# EAGLE design simreader_marble_perfboard (EAGLE 6.6.0)
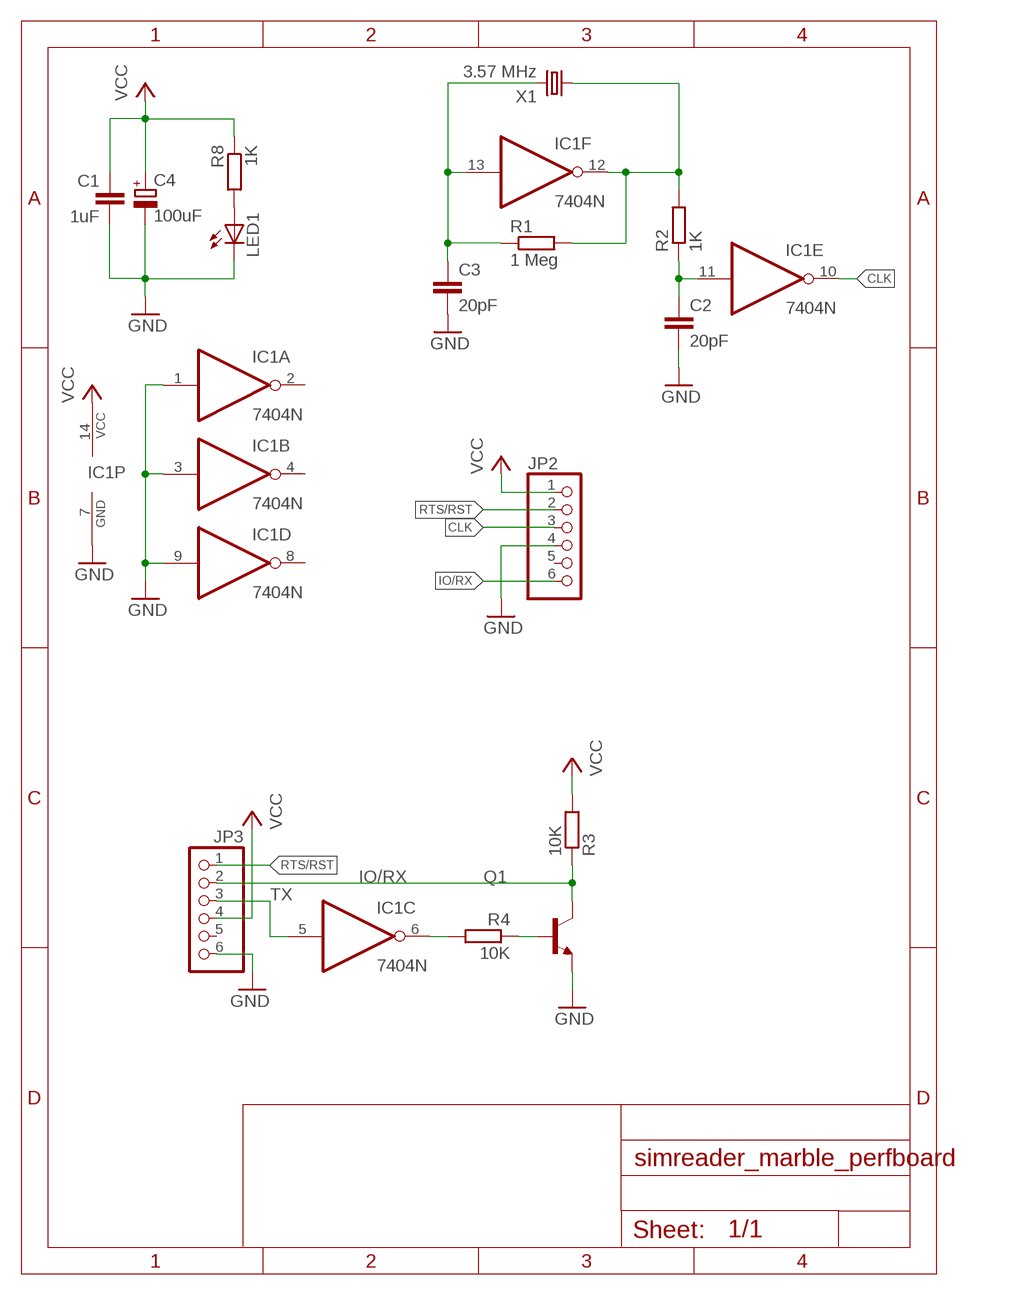
[diagram p0: schematic, sheet 1]

## Parts
C1  1uF  C-EU050-024X044  [C050-024X044]
C2  20pF  C-EU050-024X044  [C050-024X044]
C3  20pF  C-EU050-024X044  [C050-024X044]
C4  100uF  CPOL-EUB45181A  [B45181A]
IC1  7404N  [DIL14]
JP2  PINHD-1X6  [1X06]
JP3  PINHD-1X6  [1X06]
LED1  LED5MM  [LED5MM]
Q1  BC547-NPN-TO92-CBE  [TO92-CBE]
R1  1 Meg  R-EU_0204/7  [0204/7]
R2  1K  R-EU_0204/7  [0204/7]
R3  10K  R-EU_0204/7  [0204/7]
R4  10K  R-EU_0204/7  [0204/7]
R8  1K  R-EU_0204/7  [0204/7]
X1  3.57 MHz  CRYSTALHC18U-V  [HC18U-V]

## Nets
CLK: IC1.10(E:O) JP2.3
GND: C1.2 C2.2 C3.2 C4.- IC1.1(A:I) IC1.3(B:I) IC1.7(P:GND) IC1.9(D:I) JP2.4 JP3.6 LED1.K(C) Q1.E
IO/RX: JP2.6 JP3.2 Q1.C R3.1
N$1: C3.1 IC1.13(F:I) R1.1 X1.2
N$2: IC1.12(F:O) R1.2 R2.2 X1.1
N$3: C2.1 IC1.11(E:I) R2.1
N$4: IC1.6(C:O) R4.2
N$6: Q1.B R4.1
N$13: LED1.A R8.2
RTS/RST: JP2.2 JP3.1
TX: IC1.5(C:I) JP3.3
VCC: C1.1 C4.+ IC1.14(P:VCC) JP2.1 JP3.4 R3.2 R8.1
Unconnected: IC1.2(A:O) IC1.4(B:O) IC1.8(D:O) JP2.5 JP3.5

## Library data of the parts
C1-C3 = rcl:C-EU: CAPACITOR, European symbol
C4 = rcl:CPOL-EU: POLARIZED CAPACITOR, European symbol
IC1 = 74xx-us:74*04: Hex INVERTER
JP2 JP3 = pinhead:PINHD-1X6: PIN HEADER
LED1 = led:LED: LED OSRAM: - CHIPLED LG R971, LG N971, LY N971, LG Q971, LY Q971, LO R971, LY R971 LH N974, LH R974 LS Q976, LO Q976, LY Q976 LO Q996 - Hyper CHIPLED LW Q18S LB Q993, LB Q99A, LB R99A - SideLED LS A670, LO A670, LY A670, LG A670, LP A670 LB A673, LV A673, LT A673, LW A673 LH A674 LY A675 LS A676, LA A676, LO A676, LY A676, LW A676 LS A679, LY A679, LG A679 - Hyper Micro SIDELED® LS Y876, LA Y876, LO Y876, LY Y876 LT Y87S - SmartLED LW L88C, LW L88S LB L89C, LB L89S, LG L890 LS L89K, LO L89K, LY L89K LS L896, LA L896, LO L896, LY L896 - TOPLED LS T670, LO T670, LY T670, LG T670, LP T670 LSG T670, LSP T670, LSY T670, LOP T670, LYG T670 LG T671, LOG T671, LSG T671 LB T673, LV T673, LT T673, LW T673 LH T674 LS T676, LA T676, LO T676, LY T676, LB T676, LH T676, LSB T676, LW T676 LB T67C, LV T67C, LT T67C, LS T67K, LO T67K, LY T67K, LW E67C LS E67B, LA E67B, LO E67B, LY E67B, LB E67C, LV E67C, LT E67C LW T67C LS T679, LY T679, LG T679 LS T770, LO T770, LY T770, LG T770, LP T770 LB T773, LV T773, LT T773, LW T773 LH T774 LS E675, LA E675, LY E675, LS T675 LS T776, LA T776, LO T776, LY T776, LB T776 LHGB T686 LT T68C, LB T68C - Hyper Mini TOPLED® LB M676 - Mini TOPLED Santana® LG M470 LS M47K, LO M47K, LY M47K Source: http://www.osram.convergy.de LUXEON: - LUMILED® LXK2-PW12-R00, LXK2-PW12-S00, LXK2-PW14-U00, LXK2-PW14-V00 LXK2-PM12-R00, LXK2-PM12-S00, LXK2-PM14-U00 LXK2-PE12-Q00, LXK2-PE12-R00, LXK2-PE12-S00, LXK2-PE14-T00, LXK2-PE14-U00 LXK2-PB12-K00, LXK2-PB12-L00, LXK2-PB12-M00, LXK2-PB14-N00, LXK2-PB14-P00, LXK2-PB14-Q00 LXK2-PR12-L00, LXK2-PR12-M00, LXK2-PR14-Q00, LXK2-PR14-R00 LXK2-PD12-Q00, LXK2-PD12-R00, LXK2-PD12-S00 LXK2-PH12-R00, LXK2-PH12-S00 LXK2-PL12-P00, LXK2-PL12-Q00, LXK2-PL12-R00 Source: www.luxeon.com KINGBRIGHT: KA-3528ASYC Source: www.kingbright.com
Q1 = transistor:*-NPN-: NPN Transistror BF959 corrected 2008.03.06
R1-R4 R8 = rcl:R-EU_: RESISTOR, European symbol
X1 = crystal:CRYSTAL: CRYSTAL; OC_FARNELL: unknown; OC_NEWARK: unknown

## Board
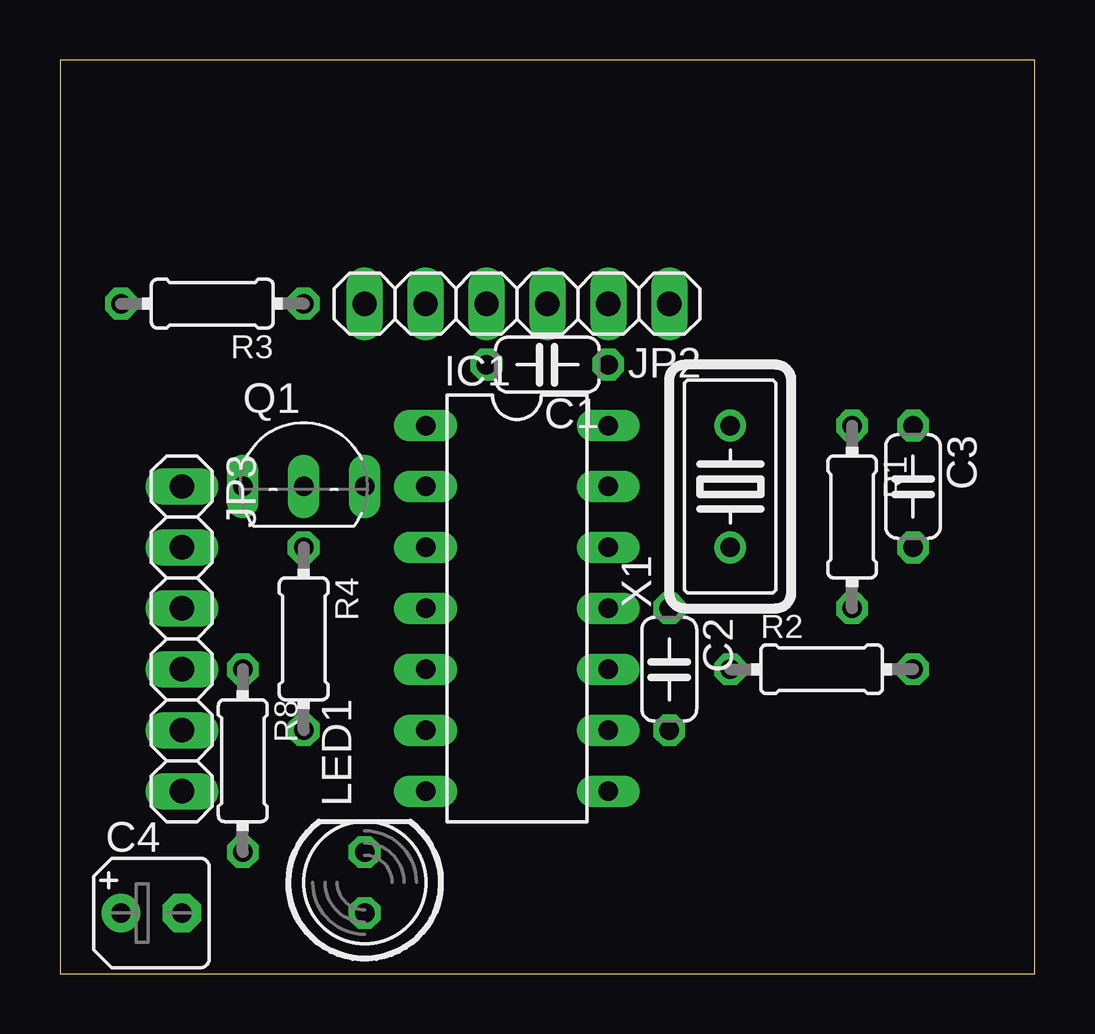
[diagram p1: board, top side]
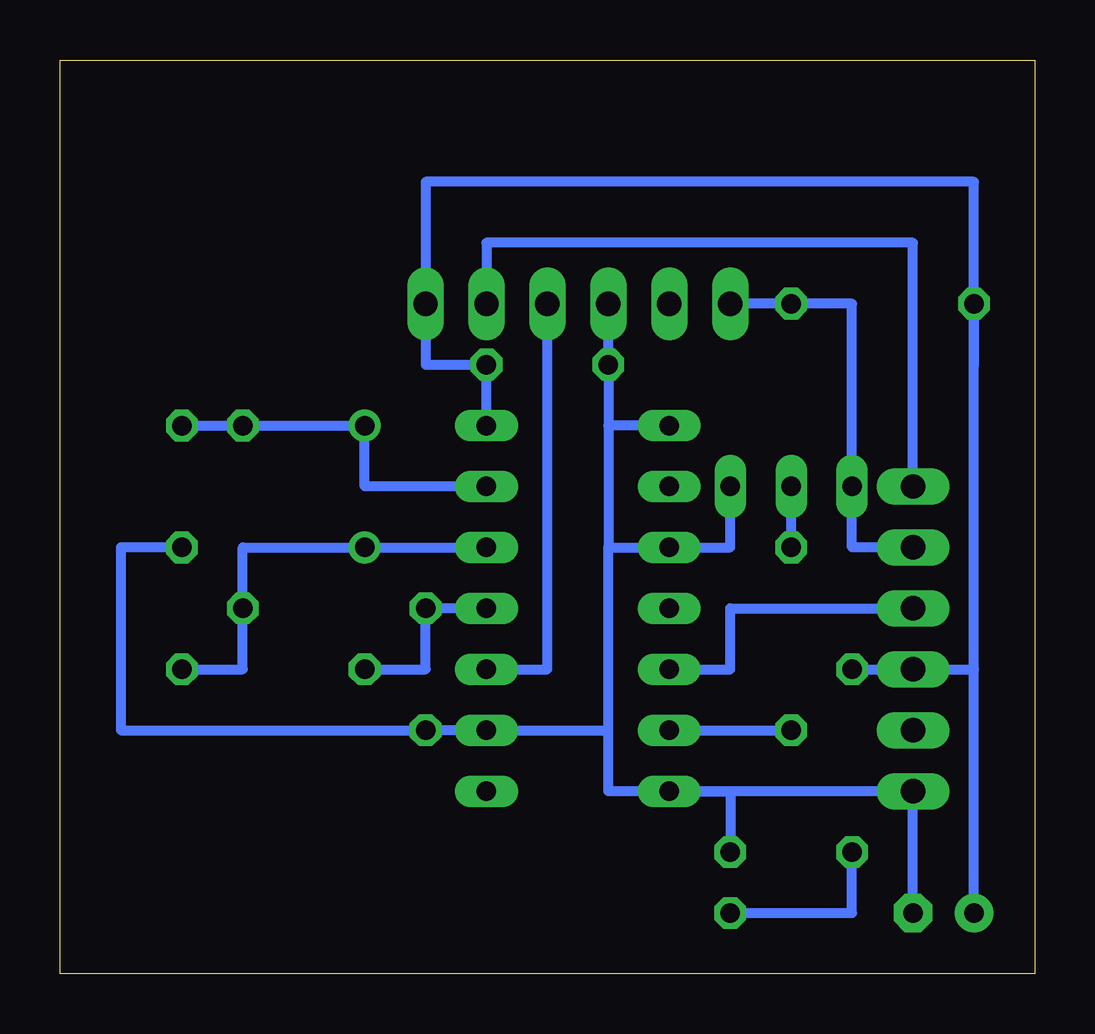
[diagram p2: board, bottom side, seen from below]

Size 40.64 x 38.1 mm. Coordinates in mm from the lower left corner, seen from the top.
Outline: 0,0 40.64,0 40.64,38.1 0,38.1 0,0
Copper layers (1*16): Top 0.035mm / dielectric 1.5mm / Bottom 0.035mm
Design rules "default": minimum track width 10mil, minimum drill 24mil, track to track 8mil, track to pad 8mil, pad to pad 8mil, via to via 8mil, smd to smd 8mil, copper to edge 40mil, drill to drill 8mil, minimum pad ring 10mil, minimum via ring 8mil, stop-mask expansion 4mil, vias tented up to drill 0mil, thermal gap 10mil

### Footprints (pad centres in the part's own frame; a part is rotated, then mirrored left to right if it is on the bottom)
C050-024X044 = drill 0.813 octagon: 1 -2.54,0; 2 2.54,0
B45181A = drill 0.813 pad 1.6: + -1.27,0 | drill 0.813 pad 1.6 octagon: - 1.27,0
DIL14 = drill 0.813 long: 1 -7.62,-3.81; 2 -5.08,-3.81; 3 -2.54,-3.81; 4 0,-3.81; 5 2.54,-3.81; 6 5.08,-3.81; 7 7.62,-3.81; 8 7.62,3.81; 9 5.08,3.81; 10 2.54,3.81; 11 0,3.81; 12 -2.54,3.81; 13 -5.08,3.81; 14 -7.62,3.81
1X06 = drill 1.016 long: 1 -6.35,0; 2 -3.81,0; 3 -1.27,0; 4 1.27,0; 5 3.81,0; 6 6.35,0
LED5MM = drill 0.813 octagon: A -1.27,0; K 1.27,0
TO92-CBE = drill 0.813 long: B 0,0; C -2.54,0; E 2.54,0
0204/7 = drill 0.813 octagon: 1 -3.81,0; 2 3.81,0
HC18U-V = drill 0.813: 1 -2.54,0; 2 2.54,0

### Placement (x,y rotation side)
C1  20.32,25.4 180 top
C2  25.4,12.7 270 top
C3  35.56,20.32 270 top
C4  3.81,2.54 0 top
IC1  19.05,15.24 270 top
JP2  19.05,27.94 180 top
JP3  5.08,13.97 270 top
LED1  12.7,3.81 90 top
Q1  10.16,20.32 0 top
R1  33.02,19.05 270 top
R2  31.75,12.7 0 top
R3  6.35,27.94 180 top
R4  10.16,13.97 270 top
R8  7.62,8.89 270 top
X1  27.94,20.32 90 top

### Tracks (layer width: path | path; a pad name or v marks a point on that pad's centre or on a via)
CLK
  Bottom 0.406: IC1.10 20.32,12.7 JP2.3
GND
  Bottom 0.406: 17.78,22.86 C1.2 JP2.4 | 17.78,22.86 17.78,17.78 | IC1.7 17.78,7.62 17.78,10.16 | 17.78,10.16 17.78,17.78 | 17.78,17.78 IC1.3 12.7,17.78 Q1.E | 17.78,10.16 IC1.9 C2.2 38.1,10.16 38.1,17.78 C3.2 | IC1.1 17.78,22.86 | IC1.7 JP3.6 C4.- | IC1.7 12.7,7.62 LED1.K
IO/RX
  Bottom 0.406: JP3.2 7.62,17.78 Q1.C 7.62,27.94 R3.1 JP2.6
N$1
  Bottom 0.406: IC1.13 27.94,20.32 X1.2 R1.1 C3.1
N$2
  Bottom 0.406: IC1.12 X1.1 33.02,17.78 R1.2 33.02,12.7 R2.2
N$3
  Bottom 0.406: IC1.11 C2.1 25.4,12.7 R2.1
N$4
  Bottom 0.406: IC1.6 R4.2
N$6
  Bottom 0.406: R4.1 Q1.B
N$13
  Bottom 0.406: LED1.A 7.62,2.54 R8.2
RTS/RST
  Bottom 0.406: JP3.1 5.08,30.48 22.86,30.48 JP2.2
TX
  Bottom 0.406: IC1.5 12.7,12.7 12.7,15.24 JP3.3
VCC
  Bottom 0.406: R8.1 JP3.4 2.54,12.7 | 2.54,12.7 R3.2 | R3.2 2.54,33.02 25.4,33.02 JP2.1 25.4,25.4 C1.1 IC1.14 | C4.+ 2.54,12.7 | R3.2 2.54,25.4